# EAGLE design Thru Hole Update Logic Board (EAGLE 9.6.2)
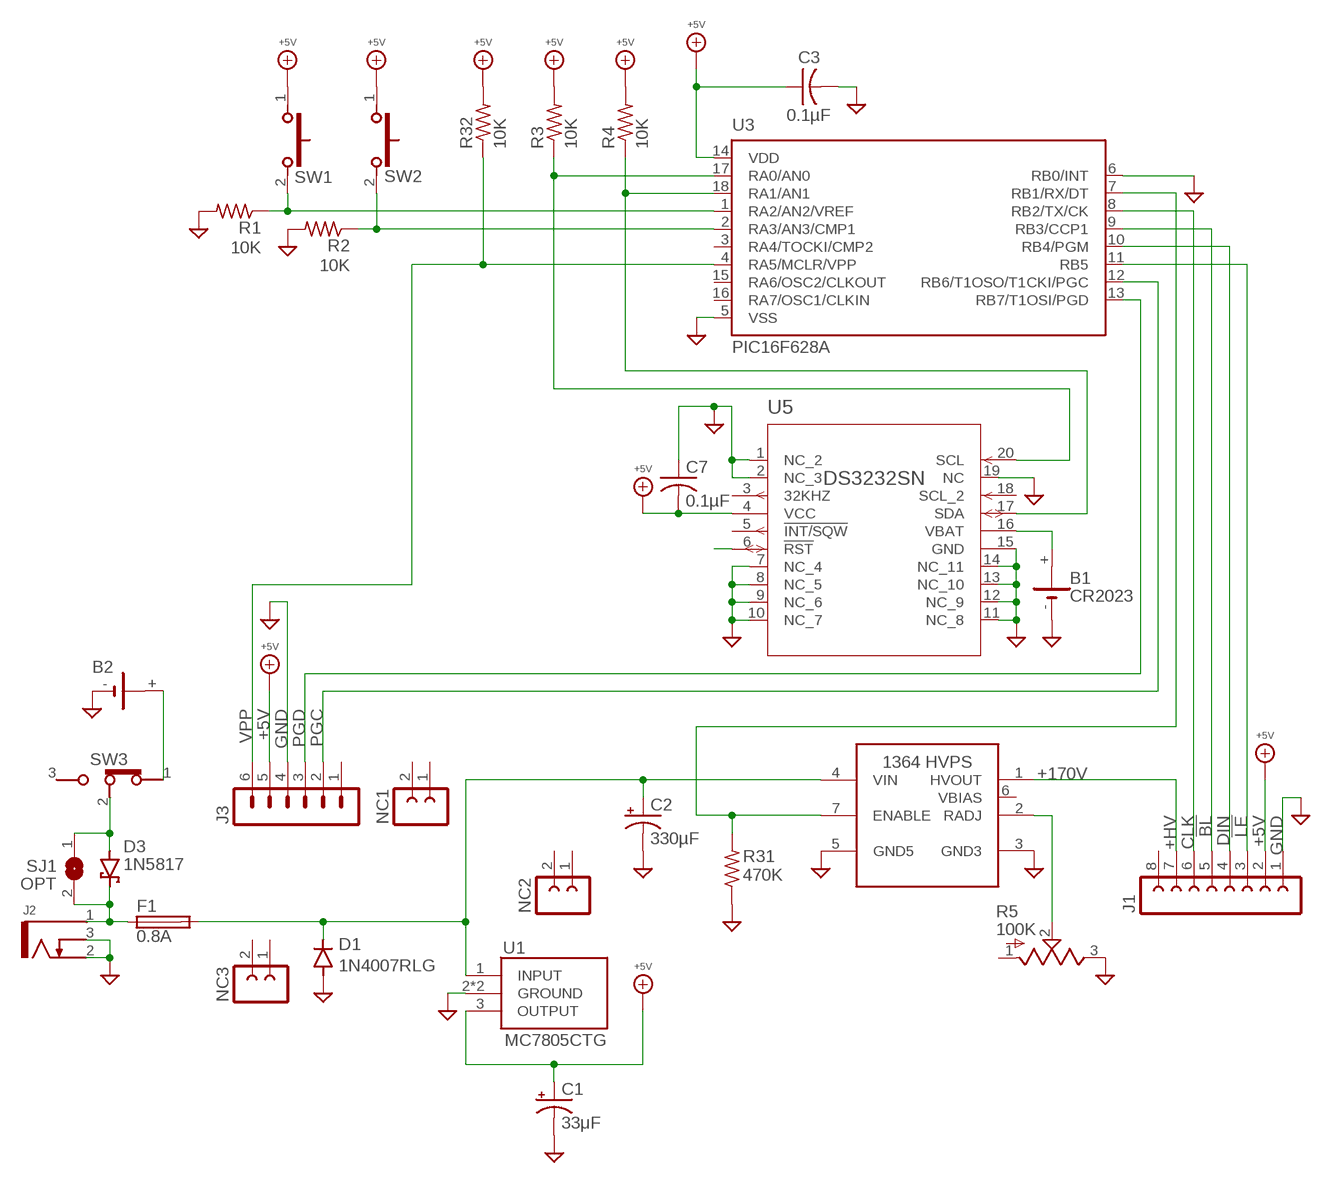
[diagram p0: schematic, sheet 1]

## Parts
B1  CR2023  BATTERY  [103]
B2  BATTERYWIRE_ATTACH  BATTERY1291  [1291]
C1  33μF  CPOL-USE2-5  [E2-5]
C2  330µF  CPOL-USE3.5-8  [E3,5-8]
C3  0.1µF  C-US  [C025-040X050]
C7  0.1µF  C-USC0805  [C0805]
D1  1N4007RLG  RECTIFIER  [DO41-7]
D3  1N5817  SCHOTTKY  [DO41-7]
F1  0.8A  FUSE  [5X20MM]
J1  FE08  [FE08]
J2  KLDX-0202-B  [KDLX-0202-X]
J3  MA06  [MA06]
NC1  FE02  [FE02]
NC2  FE02  [FE02]
NC3  FE02  [FE02]
R1  10K  R-US0207/10  [0207/10]
R2  10K  R-US0207/10  [0207/10]
R3  10K  R-US0207/10  [0207/10]
R4  10K  R-US0207/10  [0207/10]
R5  100K  R-US_TRIM  [PV37W]
R31  470K  R-US0207/10  [0207/10]
R32  10K  R-US0207/10  [0207/10]
SJ1  OPT  SJ  [SJ]
SW1  FSMRA4JH04  SWITCH_PUSH_SPST_(ON)  [FSMRA4JH]
SW2  FSMRA4JH04  SWITCH_PUSH_SPST_(ON)  [FSMRA4JH]
SW3  5MS1S102AM6QES  SWITCH_SLIDE_SPDT_ON  [SLIDE_SPDT_MINI]
U1  MC7805CTG  [TO-220-3_RA]
U2  1364-HVPS-H  [1364-HVPS-H]
U3  PIC16F628A  PIC16F628P  [DIP-18]
U5  DS3232SN  [SOIC-20]

## Nets
!BL!: J1.5 U3.9(RB3/CCP1)
!LE!: J1.3 U3.11(RB5)
+5V: C1.+ C3.1 C7.2 J1.2 J3.5 R3.2 R4.2 R32.2 SW1.1 SW2.1 U1.3(OUTPUT) U3.14(VDD) U5.4(VCC)
+9V: D3.C F1.1A F1.1B J2.1 SJ1.2
+9V_1: C2.+ D1.C F1.2A F1.2B U1.1(INPUT) U2.4(VIN)
+9V_2: D3.A SJ1.1 SW3.2(COM)
+9V_4: B2.+ SW3.1(POS_1)
+HV: J1.7 U2.1(HVOUT)
BAT: B1.+ U5.16(VBAT)
CLK: J1.6 U3.8(RB2/TX/CK)
DIN: J1.4 U3.10(RB4/PGM)
ENABLE: R31.2 U2.7(ENABLE) U3.7(RB1/RX/DT)
GND: B1.- B2.- C1.- C2.- C3.2 C7.1 D1.A J1.1 J2.2 J2.3 J3.4 R1.2 R2.2 R5.3 R31.1 U1.2(GROUND) U1.2_1(GROUND) U2.3(GND3) U2.5(GND5) U3.5(VSS) U3.6(RB0/INT) U5.1(NC_2) U5.2(NC_3) U5.7(NC_4) U5.8(NC_5) U5.9(NC_6) U5.10(NC_7) U5.11(NC_8) U5.12(NC_9) U5.13(NC_10) U5.14(NC_11) U5.15(GND) U5.19(NC)
MYSTERY_3: U5.6(!RST)
PGC: J3.2 U3.12(RB6/T1OSO/T1CKI/PGC)
PGD: J3.3 U3.13(RB7/T1OSI/PGD)
RADJ: R5.2 U2.2(RADJ)
SCL: R3.1 U3.17(RA0/AN0) U5.20(SCL)
SDA: R4.1 U3.18(RA1/AN1) U5.17(SDA)
SW1: R1.1 SW1.2 U3.1(RA2/AN2/VREF)
SW2: R2.1 SW2.2 U3.2(RA3/AN3/CMP1)
VPP: J3.6 R32.1 U3.4(RA5/MCLR/VPP)
Unconnected: J1.8 J3.1 NC1.1 NC1.2 NC2.1 NC2.2 NC3.1 NC3.2 R5.1 SW3.3(POS_2) U2.6(VBIAS) U3.3(RA4/TOCKI/CMP2) U3.15(RA6/OSC2/CLKOUT) U3.16(RA7/OSC1/CLKIN) U5.3(32KHZ) U5.5(!INT/SQW) U5.18(SCL_2)

## Notes on the sheet
- +170V

## Library data of the parts
B1 B2 = My Imported Components:BATTERY: LI BATTERY Varta
C1 C2 = My Imported Components:CPOL-US
C3 = My Imported Components:C-US
C7 = rcl:C-US: CAPACITOR, American symbol; SPICEPREFIX: C
D1 = My Imported Components:RECTIFIER
D3 = My Imported Components:SCHOTTKY
F1 = My Imported Components:FUSE
J1 = My Imported Components:FE08: FEMALE HEADER; OC_FARNELL: unknown; OC_NEWARK: unknown
J2 = My Imported Components:KLDX-0202-B: https://www.mouser.com/datasheet/2/222/KLDX_0202-334781.pdf
J3 = My Imported Components:MA06: PIN HEADER; OC_FARNELL: unknown; OC_NEWARK: unknown
NC1-NC3 = My Imported Components:FE02: FEMALE HEADER
R1-R4 R31 R32 = My Imported Components:R-US: RESISTOR, American symbol; SPICEPREFIX: R
R5 = My Imported Components:R-US_TRIM: Res Cermet Trimmer 1M Ohm 10% 1/4W 12(Elec)Turn 1.8mm (6.4 X 4 X 7.7mm) Pin Thru-Hole Bulk Check prices <https://pricing.snapeda.com/parts/PV37W104C01B00/Bourns/view-part?ref=eda>; AVAILABILITY: Good; DESCRIPTION: 100 kOhms 0.25W, 1/4W PC Pins Through Hole Trimmer Potentiometer Cermet 12 Turn Top Adjustment; MF: Bourns; MP: PV37W104C01B00; PACKAGE: 3224X Bourns; PRICE: None; PURCHASE-URL: https://pricing.snapeda.com/search/part/PV37W104C01B00/?ref=eda
SJ1 = jumper:SJ: SMD solder JUMPER
SW1 SW2 = My Imported Components:SWITCH_PUSH_SPST_(ON)
SW3 = My Imported Components:SWITCH_SLIDE_SPDT_ON
U1 = My Imported Components:MC7805CTG: Voltage regulator,MC7805CT 5V 1A ON Semiconductor MC7805CTG, Single Linear Voltage Regulator, 1A 5 V, +/-4%, 3-Pin TO-220 Source: Datasheet <http://www.onsemi.com/pub/Collateral/MC7800-D.PDF>; ARROW_PART_NUMBER: MC7805CTG; ARROW_PRICE-STOCK: https://www.arrow.com/en/products/mc7805ctg/on-semiconductor; DESCRIPTION: Voltage regulator,MC7805CT 5V 1A ON Semiconductor MC7805CTG, Single Linear Voltage Regulator, 1A 5 V, +/-4%, 3-Pin TO-220; HEIGHT: 4.82mm; MANUFACTURER_NAME: ON Semiconductor; MANUFACTURER_PART_NUMBER: MC7805CTG; MOUSER_PART_NUMBER: 863-MC7805CTG; MOUSER_PRICE-STOCK: https://www.mouser.co.uk/ProductDetail/ON-Semiconductor/MC7805CTG/?qs=%252B9%2Fcbd0IE0SRQQJXyw%252B9hQ%3D%3D
U2 = My Imported Components:1364-HVPS-H: https://www.shop-tes.com/content/Datasheets/8002K.pdf
U3 = My Imported Components:PIC16F62*: FLASH-Based 8-Bit CMOS Microcontroller Source: http://ww1.microchip.com/downloads/en/DeviceDoc/40300C.pdf; MF: MICROCHIP; MPN: PIC16F628-04I/P; OC_FARNELL: 9760407; OC_NEWARK: 19C7272
U5 = My Imported Components:DS3232SN; BUILT_BY: EMA_UL_Team; MANUFACTURER_PART_NUMBER: ds3232sn#; SOURCELIBRARY: Maxim_2009-12-17_1; VENDOR: Maxim Integrated Products

## Board
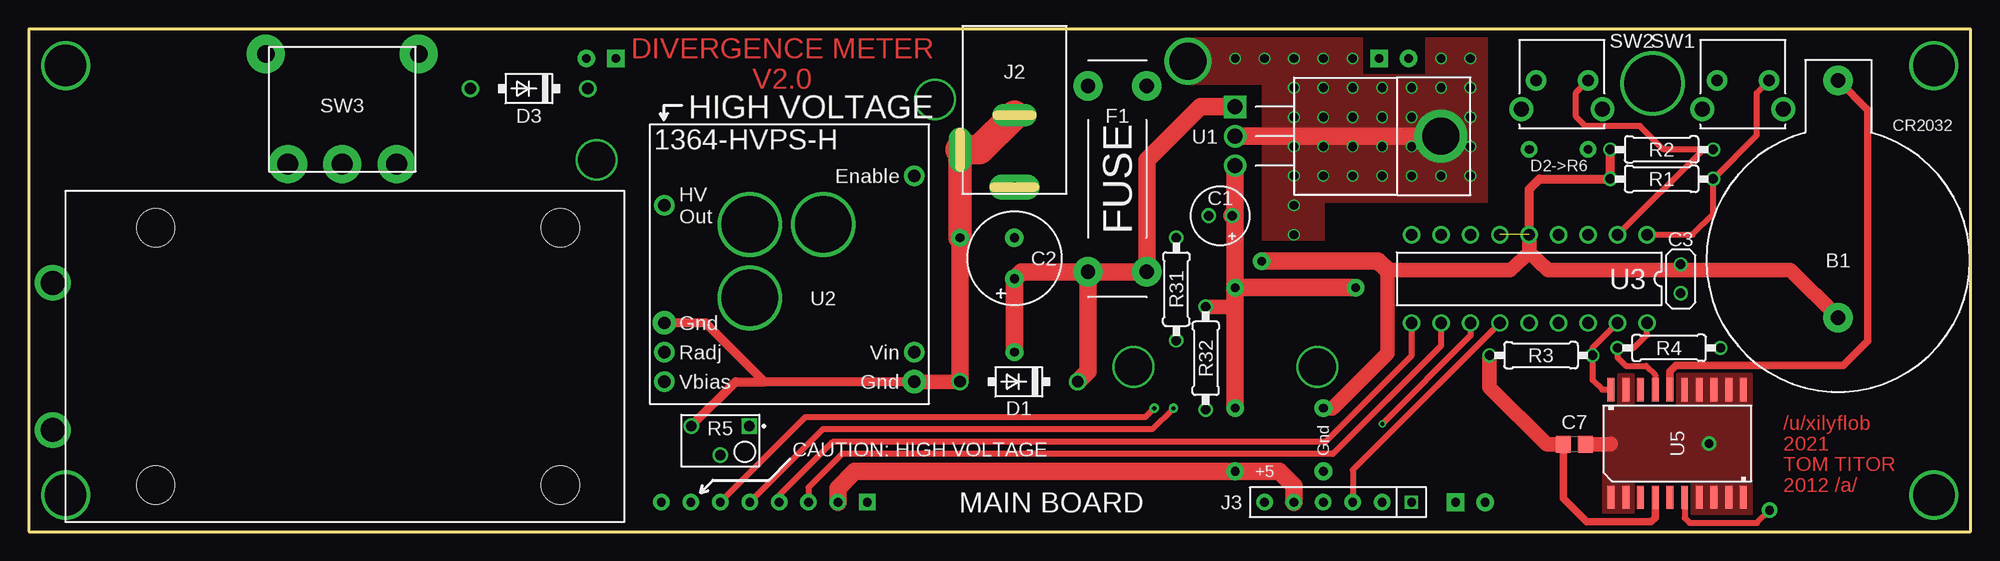
[diagram p1: board, top side]
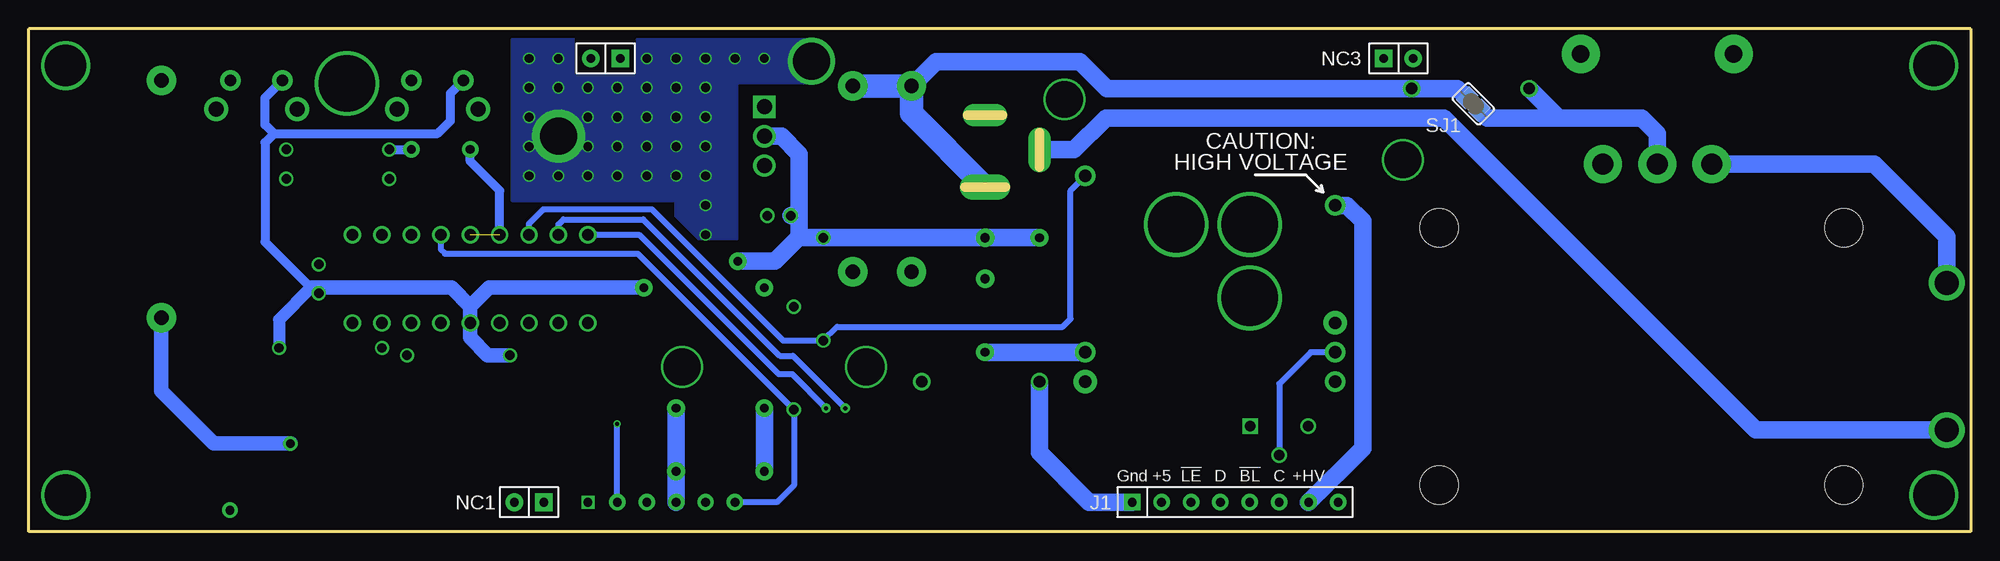
[diagram p2: board, bottom side, seen from below]

Size 167.64 x 43.43 mm. Coordinates in mm from the lower left corner, seen from the top.
Outline: 0,0 167.64,0 167.64,43.43 0,43.43 0,0
Copper layers (1*16): Top 0.035559375mm / dielectric 1.6mm / Bottom 0.035559375mm
Design rules "oshpark-2layer *": minimum track width 6mil, minimum drill 10mil, track to track 6mil, track to pad 6mil, pad to pad 6mil, via to via 6mil, smd to smd 6mil, copper to edge 15mil, drill to drill 6mil, minimum pad ring 5mil, minimum via ring 5mil, stop-mask expansion 2.5mil, vias tented up to drill 0mil, thermal gap 10mil

### Footprints (pad centres in the part's own frame; a part is rotated, then mirrored left to right if it is on the bottom)
103 = drill 1.27 pad 2.54: + 0,0; - 0,-20.498
1291 = drill 2.057: + 8.89,-6.35; - 8.89,6.35 | hole 3.302: -34.925,11.113; 0,11.113; 0,-11.113; -34.925,-11.113
E2-5 = drill 0.813 pad 1.27: + -1.016,0; - 1.016,0
E3,5-8 = drill 0.813 pad 1.6: + -1.778,0; - 1.778,0
C025-040X050 = drill 0.813: 1 -1.25,0; 2 1.25,0
C0805 = smd 1.3 x 1.5: 1 -0.95,0; 2 0.95,0
DO41-7 = drill 1: A 5.08,0; C -5.08,0
5X20MM = drill 1.245 pad 2.54: 1A -8.026,2.54; 1B -8.026,-2.54; 2A 8.026,2.54; 2B 8.026,-2.54
FE08 = drill 0.75 pad 1.422 square: 1 -8.89,0 | drill 0.75 pad 1.422: 2 -6.35,0; 3 -3.81,0; 4 -1.27,0; 5 1.27,0; 6 3.81,0; 7 6.35,0; 8 8.89,0
KDLX-0202-X = drill 0.8 pad 2.184 long: 1 13.9,0 | drill 0.8 pad 1.93 long: 2 7.7,0; 3 10.7,-4.7
MA06 = drill 0.75 square: 1 -6.35,0 | drill 0.75 pad 1.422: 2 -3.81,0; 3 -1.27,0; 4 1.27,0; 5 3.81,0; 6 6.35,0
FE02 = drill 0.75 pad 1.524 square: 1 -1.27,0 | drill 0.75 pad 1.524: 2 1.27,0
0207/10 = drill 0.813: 1 -4.445,0; 2 4.445,0
PV37W = drill 0.9 square: 1 -2.5,-1.25 | drill 0.9: 2 0,1.25; 3 2.5,-1.25
SJ = smd 1.168 x 1.6: 1 -0.762,0; 2 0.762,0
FSMRA4JH = drill 0.991 pad 1.753: 1 4.496,0; 2 0,0 | drill 1.295 pad 2.057: 3 -1.245,2.489; 4 5.766,2.489
SLIDE_SPDT_MINI = drill 1.8 pad 3.302: 1 -4.699,0; 2 0,0; 3 4.699,0 | drill 1.5 pad 3.302: P$4 -6.604,9.525; P$5 6.604,9.525
TO-220-3_RA = drill 1.29 pad 1.935 square: 1 0,0 | drill 1.29 pad 1.935: 2 2.54,0; 3 5.08,0 | drill 3.175 pad 4.572: 2_1 2.54,17.78
1364-HVPS-H = drill 1.067 pad 1.778: 1 1.27,17.145; 2 1.27,4.445; 4 22.86,4.445; 6 1.27,1.905; 7 22.86,19.685 | drill 1.067 pad 2.032: 3 1.27,6.985; 5 22.86,1.905
DIP-18 = drill 1: 1 -10.16,-3.81; 2 -7.62,-3.81; 3 -5.08,-3.81; 4 -2.54,-3.81; 5 0,-3.81; 6 2.54,-3.81; 7 5.08,-3.81; 8 7.62,-3.81; 9 10.16,-3.81; 10 10.16,3.81; 11 7.62,3.81; 12 5.08,3.81; 13 2.54,3.81; 14 0,3.81; 15 -2.54,3.81; 16 -5.08,3.81; 17 -7.62,3.81; 18 -10.16,3.81
SOIC-20 = smd 2 x 0.6: 1 -4.65,5.715; 2 -4.65,4.445; 3 -4.65,3.175; 4 -4.65,1.905; 5 -4.65,0.635; 6 -4.65,-0.635; 7 -4.65,-1.905; 8 -4.65,-3.175; 9 -4.65,-4.445; 10 -4.65,-5.715; 11 4.65,-5.715; 12 4.65,-4.445; 13 4.65,-3.175; 14 4.65,-1.905; 15 4.65,-0.635; 16 4.65,0.635; 17 4.65,1.905; 18 4.65,3.175; 19 4.65,4.445; 20 4.65,5.715

### Placement (x,y rotation side)
B1  156.21,38.99 0 top
B2  10.95,15.14 180 top
C1  102.87,27.3 180 top
C2  85.09,23.62 90 top
C3  142.62,21.84 90 top
C7  133.44,7.54 180 top
D1  85.47,12.95 180 top
D3  43.18,38.28 180 top
F1  93.98,30.48 270 top
J1  63.5,2.54 0 bottom
J2  85.09,43.69 270 top
J3  113.03,2.54 180 top
NC1  124.46,2.54 180 bottom
NC2  117.86,40.89 180 bottom
NC3  49.4,40.89 0 bottom
R1  140.97,30.48 180 top
R2  140.97,33.02 180 top
R3  130.56,15.24 180 top
R4  141.6,15.88 0 top
R5  59.69,7.87 180 top
R31  99.06,20.95 270 top
R32  101.6,14.99 90 top
SJ1  42.93,36.96 135 bottom
SW1  150.24,38.99 180 top
SW2  134.62,38.99 180 top
SW3  27.05,31.75 0 top
U1  104.14,36.7 270 top
U2  53.59,11.05 0 top
U3  129.54,21.84 180 top
U5  142.32,7.62 90 top

### Tracks (layer width: path | path; a pad name or v marks a point on that pad's centre or on a via)
!BL!  (via drill 0.35 pad 0.79)
  Top 0.508: J1.5 68.53,8.84 96.98,8.84 v98.81,10.67
  Bottom 0.508: U3.9 114.96,25.65 102.89,13.59 101.73,13.59 v98.81,10.67
!LE!
  Top 0.508: U3.11 121.92,16.05 112.57,6.71 70.21,6.71 67.31,3.81 J1.3
+5V  (via drill 0.75 pad 1.52)
  Top 0.635: C7.2 132.49,2.89 134.52,0.86 140.06,0.86 140.41,1.22 U5.4
  Top 1.27: R32.2 104.06,19.43 104.14,19.36 | R3.2 126.11,12.47 131.04,7.54 C7.2
  Top 1.524: U1.3 104.14,27.2 | 104.14,27.2 v104.14,21.08 | v104.14,21.08 104.14,19.36 v104.14,10.67 | J1.2 69.85,3.76 71.3,5.21 v104.14,5.21 107.97,5.21 109.22,3.96 J3.5 | C1.+ 104.11,27.23 104.14,27.2 | v104.14,21.08 v114.55,21.08
  Bottom 0.762: 146.47,34.39 132.36,34.39 131.24,35.51 131.24,37.87 SW2.1 | 146.47,34.39 147.24,33.62 147.24,25.03 143.3,21.08 | 146.47,34.39 147.24,35.16 147.24,37.49 SW1.1
  Bottom 1.016: 143.3,21.08 146.05,18.33 R4.2
  Bottom 1.27: v114.55,21.08 127.91,21.08 129.54,19.46 | 129.54,19.46 U3.14 129.54,16.76 128.02,15.24 R3.2 | 142.62,21.08 131.17,21.08 129.54,19.46 | 142.62,21.08 143.3,21.08 | C3.1 142.62,21.08
  Bottom 1.524: v104.14,10.67 v104.14,5.21
+9V
  Bottom 1.016: 43.71,37.69 43.49,37.47 SJ1.2
  Bottom 1.524: F1.1B 89.33,40.62 76.91,40.62 74.57,38.28 D3.C 44.3,38.28 43.71,37.69
  Bottom 2.032: J2.1 91.44,36.14 F1.1B F1.1A
+9V_1  (via drill 0.75 pad 1.52)
  Top 1.524: F1.2B F1.2A 96.52,32.08 101.14,36.7 U1.1 | F1.2B 85.7,22.45 C2.+ v85.09,15.49 | F1.2B 91.44,13.84 D1.C
  Bottom 1.524: U2.4 v85.09,15.49
+9V_2
  Bottom 1.016: SJ1.1 42.41,36.39 42.11,36.09
  Bottom 1.524: SW3.2 27.05,34.39 28.37,35.71 35.53,35.71 | D3.A 35.53,35.71 | 42.11,36.09 41.73,35.71 35.53,35.71
+9V_4
  Bottom 1.524: B2.+ 2.06,25.48 8.33,31.75 SW3.1
+HV
  Bottom 1.524: U2.1 53.85,28.19 52.48,26.82 52.48,7.21 J1.7
BAT
  Top 0.635: B1.+ 158.78,36.42 158.78,16.48 156.67,14.38 142.22,14.38 141.68,13.84 U5.16
CLK  (via drill 0.35 pad 0.79)
  Top 0.508: v97.16,10.67 96.37,9.88 67.03,9.88 J1.6
  Bottom 0.508: U3.8 121.92,26.54 121.49,26.98 114.61,26.98 102.82,15.19 101.68,15.19 v97.16,10.67
DIN
  Top 0.508: U3.10 119.38,15.19 111.94,7.75 69.39,7.75 64.77,3.12 J1.4
ENABLE
  Bottom 0.508: U2.7 77.7,29.49 77.7,18.39 78.38,17.7 97.87,17.7 R31.2 102.51,16.51 113.87,27.86 123.22,27.86 124.46,26.62 U3.7
GND  (via drill 0.75, 0.75 pad 1.27, 0.75 pad 1.42, 0.75 pad 1.52, 3.17 pad 4.06)  (1 unrouted)
  Top 0.762: U2.3 58.44,18.03 63.52,12.95 | U3.5 129.54,29.59 130.43,30.48 R1.2 R2.2 | U2.5 63.52,12.95 | R5.3 61.02,12.95 63.52,12.95
  Top 1.27: D1.A U2.5 | 142.62,22.61 131.17,22.61 129.54,24.13 | U3.5 129.54,24.13 | 129.54,24.13 127.91,22.61 117.3,22.61 117.3,15.42 112.55,10.67 v111.76,10.67 | B1.- 152.09,22.61 142.62,22.61 | C7.1 136.53,7.54 136.58,7.59 | C3.2 142.62,22.61
  Top 1.524: v80.39,25.4 D1.A | v106.43,23.37 116.48,23.37 117.3,22.61 | U1.2 U1.2_1
  Top 2.032: J2.3 v80.39,25.4
  Top 2.54: J2.2 82.09,32.99 J2.3
  Bottom 0.762: U3.6 127,29.46 129.54,32 v129.54,33.02 | R2.2 v134.62,33.02
  Bottom 1.27: B1.- 156.21,12.14 151.69,7.62 v145.06,7.62
  Bottom 1.524: v80.39,25.4 C2.- R31.1 101.14,25.4 | J1.1 76.1,2.54 80.39,6.83 D1.A | 101.14,25.4 101.14,27.3 | 101.14,27.3 101.14,32.64 102.67,34.16 U1.2 | 101.14,25.4 101.19,25.4 103.23,23.37 v106.43,23.37 | C1.- 101.14,27.3 | v111.76,10.67 v111.76,5.21 J3.4 | J2.3 77.4,32.99 74.65,35.74 45.49,35.74 18.54,8.79 B2.-
  other vias: 104.14,40.89 106.68,40.89 109.22,40.89 111.76,40.89 114.3,40.89 109.22,38.35 111.76,38.35 114.3,38.35 116.84,38.35 100.08,40.64 119.38,38.35 121.92,38.35 124.46,38.35 124.46,35.81 124.46,33.27 124.46,30.73 121.92,30.73 119.38,30.73 116.84,30.73 114.3,30.73 111.76,30.73 109.22,30.73 109.22,28.19 109.22,25.65 109.22,33.27 111.76,33.27 114.3,33.27 116.84,33.27 119.38,33.27 119.38,35.81 116.84,35.81 114.3,35.81 111.76,35.81 109.22,35.81 124.46,40.89 121.92,40.89
  pour Top (no thermals): 100.15,42.6 100.15,38.68 106.5,38.68 106.5,25.22 111.81,25.22 111.81,28.52 125.91,28.52 125.91,42.6 120.6,42.6 120.6,39.42 115.11,39.42 115.11,42.6
  pour Bottom (no thermals): 100.15,42.6 100.15,38.68 106.5,38.68 106.5,25.22 109.8,25.22 111.81,27.23 111.81,28.52 125.91,28.52 125.91,42.6 120.6,42.6 120.6,39.42 115.11,39.42 115.11,42.6
  pour Top (no thermals): 148.72,13.67 148.72,1.5 143.59,1.5 143.59,4.37 138.51,4.37 138.51,1.63 135.92,1.63 135.92,10.9 137.24,10.9 137.24,13.61 138.51,13.61 138.51,10.9 142.32,10.9 142.32,13.67
MYSTERY_3  (via drill 0.75 pad 1.35)
  Top 0.508: U5.6 142.95,1.19 143.38,0.76 149.2,0.76 v150.29,1.85
N$3  (via drill 3.17 pad 3.61)
  other vias: 49.02,32.13
N$21  (via drill 3.58 pad 4.27)
  other vias: 3.17,40.26
N$22  (via drill 3.58 pad 4.27)
  other vias: 3.17,3.17
N$23  (via drill 3.58 pad 4.27)
  other vias: 164.47,40.26
N$24  (via drill 3.58 pad 4.27)
  other vias: 164.47,3.17
N$25  (via drill 3.17 pad 3.61)
  other vias: 78.23,37.34
N$26  (via drill 3.17 pad 3.61)
  other vias: 95.38,14.22
N$27  (via drill 3.17 pad 3.61)
  other vias: 111.25,14.22
N$28  (via drill 4.88 pad 5.59)
  other vias: 62.23,26.54
N$29  (via drill 4.88 pad 5.59)
  other vias: 68.58,26.54
N$30  (via drill 4.88 pad 5.59)
  other vias: 62.23,20.19
N$31  (via drill 4.88 pad 5.59)
  other vias: 140.18,38.73
PGC  (via drill 0.35)
  Top 0.508: U3.12 124.46,16.94 v116.84,9.32
  Bottom 0.508: J3.2 v116.84,9.32
PGD
  Top 0.508: J3.3 114.3,5.33 U3.13
RADJ
  Bottom 0.508: U2.2 56.97,15.49 59.69,12.78 R5.2
SCL
  Top 0.508: U3.17 135,15.88 R3.1 135,13.11 135.84,12.27 U5.20
SDA
  Top 0.508: U3.18 139.7,16.99 138.58,15.88 R4.1 137.16,15.04 137.87,14.33 139.62,14.33 140.41,13.54 U5.17
SW1
  Top 0.508: U3.1 143.64,25.65 145.41,27.43 R1.1 149.17,34.24 149.17,37.92 SW1.2
SW2
  Top 0.508: 144.55,33.02 137.19,25.65 U3.2 | SW2.2 133.58,37.95 133.58,35.84 134.37,35.05 139.09,35.05 141.12,33.02 144.55,33.02 | R2.1 144.55,33.02
VPP
  Bottom 0.508: U3.4 132.08,24.38 131.72,24.03 115.09,24.03 R32.1 101.6,3.99 103.05,2.54 J3.6

### Text on the board
Top: DIVERGENCE METER / V2.0 | /u/xilyflob / 2021 / TOM TITOR / 2012 /a/
tPlace: HIGH VOLTAGE | CR2032 | D2->R6 | Gnd | CAUTION: HIGH VOLTAGE | +5 | MAIN BOARD
bPlace: CAUTION: / HIGH VOLTAGE | +HV | C | !BL! | D | !LE! | +5 | Gnd
tStop: DIVERGENCE METER / V2.0 | /u/xilyflob / 2021 / TOM TITOR / 2012 /a/